# EAGLE design motherboard_v1 (EAGLE 7.2.0)
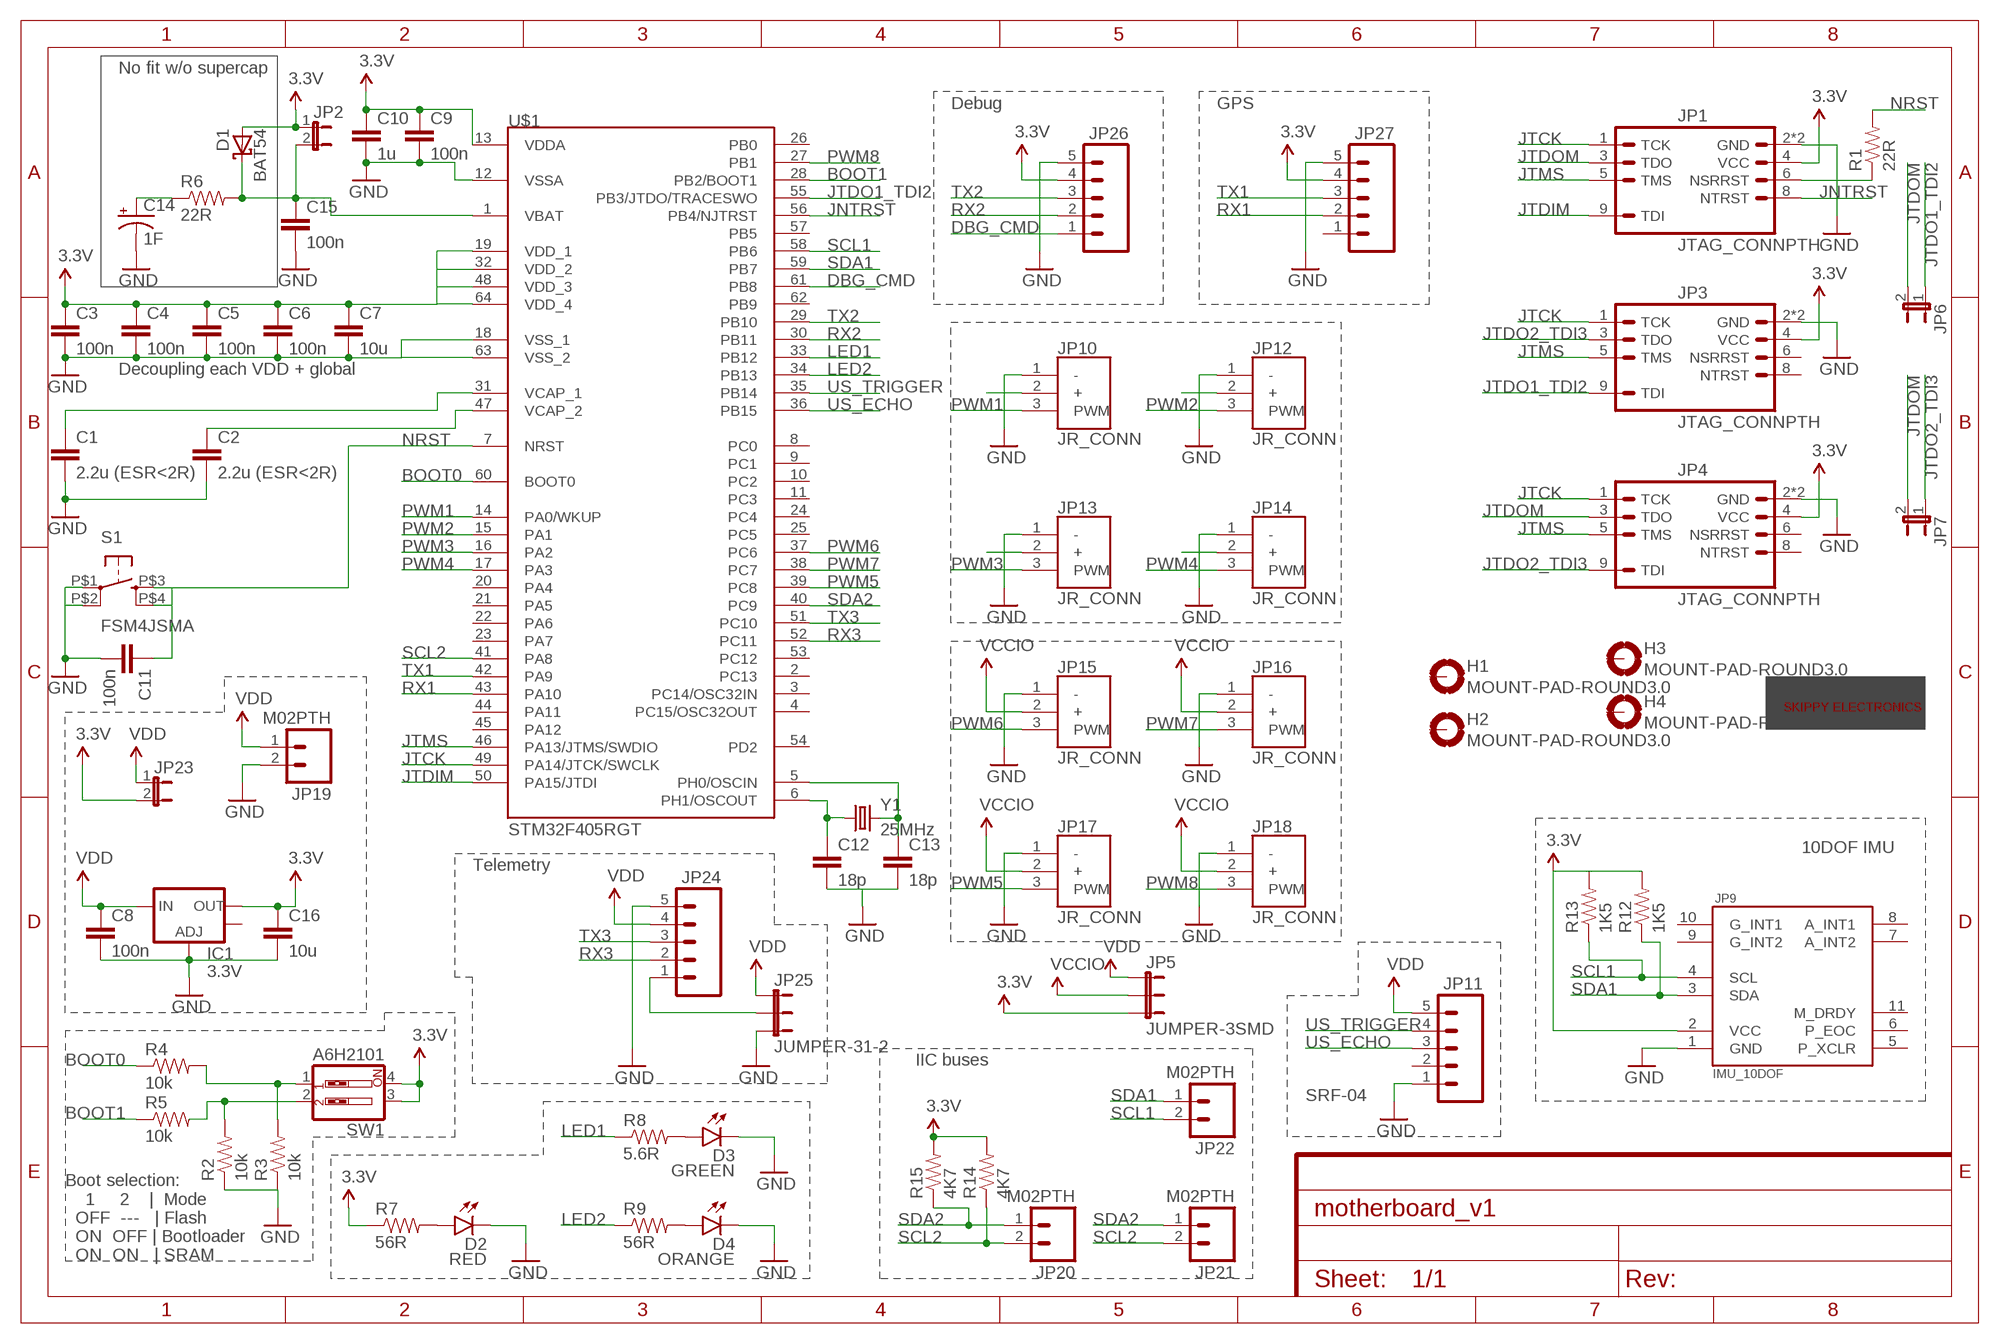
[diagram p0: schematic, sheet 1]
FRAME1 (FRAME-A4L): CNAME: SkippyElectronics; CREVISION: 1.0.0; DESIGNER: Christophe Huriaux

## Parts
C1  2.2u (ESR<2R)  CAP1206  [1206]
C2  2.2u (ESR<2R)  CAP1206  [1206]
C3  100n  CAP0805  [0805]
C4  100n  CAP0805  [0805]
C5  100n  CAP0805  [0805]
C6  100n  CAP0805  [0805]
C7  10u  CAP1206  [1206]
C8  100n  CAP1206  [1206]
C9  100n  CAP0805  [0805]
C10  1u  CAP1206  [1206]
C11  100n  CAP1206  [1206]
C12  18p  CAP1206  [1206]
C13  18p  CAP1206  [1206]
C14  1F  SUPERCAP  [CPOL-RADIAL-D165-P508]
C15  100n  CAP0805  [0805]
C16  10u  CAP1206  [1206]
D1  BAT54  [SOT23]
D2  RED  LED1206  [LED-1206]
D3  GREEN  LED1206  [LED-1206]
D4  ORANGE  LED1206  [LED-1206]
H1  MOUNT-PAD-ROUND3.0  [3,0-PAD]
H2  MOUNT-PAD-ROUND3.0  [3,0-PAD]
H3  MOUNT-PAD-ROUND3.0  [3,0-PAD]
H4  MOUNT-PAD-ROUND3.0  [3,0-PAD]
IC1  3.3V  V_REG_LM1117SOT223  [SOT223]
JP1  JTAG_CONNPTH  [AVR_ICSP]
JP2  JUMPER-2SMD-NO  [SJ_2S-NO]
JP3  JTAG_CONNPTH  [AVR_ICSP]
JP4  JTAG_CONNPTH  [AVR_ICSP]
JP5  JUMPER-3SMD  [SJ_3]
JP6  JUMPER-2SMD-NO  [SJ_2S-NO]
JP7  JUMPER-2SMD-NO  [SJ_2S-NO]
JP9  IMU_10DOF  [IMU_10DOF]
JP10  JR_CONN  [1X03]
JP11  M05PTH  [1X05]
JP12  JR_CONN  [1X03]
JP13  JR_CONN  [1X03]
JP14  JR_CONN  [1X03]
JP15  JR_CONN  [1X03]
JP16  JR_CONN  [1X03]
JP17  JR_CONN  [1X03]
JP18  JR_CONN  [1X03]
JP19  M02PTH  [1X02]
JP20  M02PTH  [1X02]
JP21  M02PTH  [1X02]
JP22  M02PTH  [1X02]
JP23  JUMPER-2SMD-NO  [SJ_2S-NO]
JP24  M05PTH  [1X05]
JP25  JUMPER-31-2  [SJ_3_PASTE1&2]
JP26  M05PTH  [1X05]
JP27  M05PTH  [1X05]
R1  22R  RESISTOR1206  [1206]
R2  10k  RESISTOR1206  [1206]
R3  10k  RESISTOR1206  [1206]
R4  10k  RESISTOR1206  [1206]
R5  10k  RESISTOR1206  [1206]
R6  22R  RESISTOR1206  [1206]
R7  56R  RESISTOR1206  [1206]
R8  5.6R  RESISTOR1206  [1206]
R9  56R  RESISTOR1206  [1206]
R12  1K5  RESISTOR1206  [1206]
R13  1K5  RESISTOR1206  [1206]
R14  4K7  RESISTOR1206  [1206]
R15  4K7  RESISTOR1206  [1206]
S1  FSM4JSMA  TAC_SWITCH  [TYCO-FSM4JSMA]
SW1  A6H2101  SW_DIP-2-SMT-HALFSIZE  [DIPSWITCH-02-50MIL]
U$1  STM32F405RGT  [LQFP-ST-64-2]
U$2  SKIPPYTXT-PLC-10MM  [SKIPPYTXT-PLC-10MM]
Y1  25MHz  CRYSTALSMD  [HC49UP]

## Nets
3.3V: C3.1 C4.1 C5.1 C6.1 C7.1 C9.1 C10.1 C16.1 D1.1(A) IC1.2(OUT) JP1.4(VCC) JP2.1 JP3.4(VCC) JP4.4(VCC) JP5.3 JP9.2(VCC) JP23.2 JP26.4 JP27.4 R7.1 R12.2 R13.2 R14.2 R15.2 SW1.3 SW1.4 U$1.13(VDDA) U$1.19(VDD_1) U$1.32(VDD_2) U$1.48(VDD_3) U$1.64(VDD_4)
BOOT0: R4.1 U$1.60(BOOT0)
BOOT1: R5.1 U$1.28(PB2/BOOT1)
DBG_CMD: JP26.1 U$1.61(PB8)
GND: C1.2 C2.2 C3.2 C4.2 C5.2 C6.2 C7.2 C8.2 C9.2 C10.2 C11.2 C12.2 C13.2 C14.2(-) C15.2 C16.2 D2.C D3.C D4.C IC1.1(ADJ) JP1.2(GND) JP1.10(GND) JP3.2(GND) JP3.10(GND) JP4.2(GND) JP4.10(GND) JP9.1(GND) JP10.1(-) JP11.1 JP12.1(-) JP13.1(-) JP14.1(-) JP15.1(-) JP16.1(-) JP17.1(-) JP18.1(-) JP19.2 JP24.5 JP25.3 JP26.5 JP27.5 R2.1 R3.1 S1.P$1 S1.P$2 U$1.12(VSSA) U$1.18(VSS_1) U$1.63(VSS_2)
JNTRST: JP1.8(NTRST) U$1.56(PB4/NJTRST)
JTCK: JP1.1(TCK) JP3.1(TCK) JP4.1(TCK) U$1.49(PA14/JTCK/SWCLK)
JTDIM: JP1.9(TDI) U$1.50(PA15/JTDI)
JTDO1_TDI2: JP3.9(TDI) JP6.1 U$1.55(PB3/JTDO/TRACESWO)
JTDO2_TDI3: JP3.3(TDO) JP4.9(TDI) JP7.1
JTDOM: JP1.3(TDO) JP4.3(TDO) JP6.2 JP7.2
JTMS: JP1.5(TMS) JP3.5(TMS) JP4.5(TMS) U$1.46(PA13/JTMS/SWDIO)
LED1: R8.1 U$1.33(PB12)
LED2: R9.1 U$1.34(PB13)
N$1: C1.1 U$1.31(VCAP_1)
N$2: C2.1 U$1.47(VCAP_2)
N$3: C12.1 U$1.6(PH1/OSCOUT) Y1.1
N$4: JP1.6(NSRRST) R1.1
N$5: C13.1 U$1.5(PH0/OSCIN) Y1.2
N$6: R3.2 R4.2 SW1.1
N$7: R2.2 R5.2 SW1.2
N$8: D2.A R7.2
N$9: C14.1(+) R6.1
N$10: C15.1 D1.3(C) JP2.2 R6.2 U$1.1(VBAT)
N$11: D3.A R8.2
N$13: JP24.1 JP25.2
N$14: JP10.2(+)
N$15: D4.A R9.2
N$16: JP12.2(+)
N$17: JP14.2(+)
N$18: JP13.2(+)
NRST: C11.1 R1.2 S1.P$3 S1.P$4 U$1.7(NRST)
PWM1: JP10.3(PWM) U$1.14(PA0/WKUP)
PWM2: JP12.3(PWM) U$1.15(PA1)
PWM3: JP13.3(PWM) U$1.16(PA2)
PWM4: JP14.3(PWM) U$1.17(PA3)
PWM5: JP17.3(PWM) U$1.39(PC8)
PWM6: JP15.3(PWM) U$1.37(PC6)
PWM7: JP16.3(PWM) U$1.38(PC7)
PWM8: JP18.3(PWM) U$1.27(PB1)
RX1: JP27.2 U$1.43(PA10)
RX2: JP26.2 U$1.30(PB11)
RX3: JP24.2 U$1.52(PC11)
SCL1: JP9.4(SCL) JP22.2 R13.1 U$1.58(PB6)
SCL2: JP20.2 JP21.2 R14.1 U$1.41(PA8)
SDA1: JP9.3(SDA) JP22.1 R12.1 U$1.59(PB7)
SDA2: JP20.1 JP21.1 R15.1 U$1.40(PC9)
TX1: JP27.3 U$1.42(PA9)
TX2: JP26.3 U$1.29(PB10)
TX3: JP24.3 U$1.51(PC10)
US_ECHO: JP11.3 U$1.36(PB15)
US_TRIGGER: JP11.4 U$1.35(PB14)
VCCIO: JP5.2 JP15.2(+) JP16.2(+) JP17.2(+) JP18.2(+)
VDD: C8.1 IC1.3(IN) JP5.1 JP11.5 JP19.1 JP23.1 JP24.4 JP25.1
Unconnected: H1.B3,0(MOUNT) H2.B3,0(MOUNT) H3.B3,0(MOUNT) H4.B3,0(MOUNT) IC1.4(OUT) JP3.6(NSRRST) JP3.8(NTRST) JP4.6(NSRRST) JP4.8(NTRST) JP9.5(P_XCLR) JP9.6(P_EOC) JP9.7(A_INT2) JP9.8(A_INT1) JP9.9(G_INT2) JP9.10(G_INT1) JP9.11(M_DRDY) JP11.2 JP27.1 U$1.2(PC13) U$1.3(PC14/OSC32IN) U$1.4(PC15/OSC32OUT) U$1.8(PC0) U$1.9(PC1) U$1.10(PC2) U$1.11(PC3) U$1.20(PA4) U$1.21(PA5) U$1.22(PA6) U$1.23(PA7) U$1.24(PC4) U$1.25(PC5) U$1.26(PB0) U$1.44(PA11) U$1.45(PA12) U$1.53(PC12) U$1.54(PD2) U$1.57(PB5) U$1.62(PB9)

## Notes on the sheet
- No fit w/o supercap
- Debug | GPS
- Decoupling each VDD + global
- 10DOF IMU
- Telemetry
- IIC buses
- SRF-04
- Boot selection:
      1     2    |  Mode
    OFF  ---   | Flash 
    ON  OFF | Bootloader
    ON  ON   | SRAM

## Library data of the parts
C1-C13 C15 C16 = SparkFun-Capacitors:CAP: Capacitor Standard 0603 ceramic capacitor, and 0.1" leaded capacitor.
C14 = Skippy-Passive:SUPERCAP: Supercap 1F supercap
D1 = diode:BAT54: Schottky Diodes Source: Fairchild .. BAT54.pdf
D2-D4 = SparkFun-LED:LED: LEDs Standard schematic elements and footprints for 5mm, 3mm, 1206, and 0603 sized LEDs. 5mm - Spark Fun Electronics SKU : COM-00529 (and others)
H1-H4 = holes:MOUNT-PAD-ROUND: MOUNTING PAD, round
IC1 = SparkFun-PowerIC:V_REG_LM1117: Voltage Regulator LM1117 Standard adjustable voltage regulator but in SMD form. Spark Fun Electronics SKU : COM-00595; PROD_ID: VREG-08170
JP1 JP3 JP4 = connectors:JTAG_CONN: Header 5x2 Standard 10-pin dual row 0.1" header. Commonly used with AVR-ISP. Use with Spark Fun Electronics SKU: PRT-00778
JP2 JP6 JP7 JP23 = SparkFun-Retired:JUMPER-2: Jumper Basic 0.1" spaced jumper. Use with breakaway headers.
JP5 JP25 = SparkFun-Retired:JUMPER-3
JP9 = Skippy-ExtBoards:IMU_10DOF
JP10 JP12-JP18 = Skippy-Connectors:JR_CONN
JP11 JP24 JP26 JP27 = SparkFun-Connectors:M05: Header 5 Standard 5-pin 0.1" header. Use with straight break away headers (SKU : PRT-00116), right angle break away headers (PRT-00553), swiss pins (PRT-00743), machine pins (PRT-00117), and female headers (PRT-00115). Molex polarized connector foot print use with SKU : PRT-08230 with associated crimp pins and housings.
JP19-JP22 = SparkFun-Connectors:M02: Standard 2-pin 0.1" header. Use with - straight break away headers ( PRT-00116) - right angle break away headers (PRT-00553) - swiss pins (PRT-00743) - machine pins (PRT-00117) - female headers (PRT-00115) Molex polarized connector foot print use with: PRT-08233 with associated crimp pins and housings. 2.54_SCREWTERM for use with PRT-10571. 3.5mm Screw Terminal footprints for PRT-08084 5mm Screw Terminal footprints for use with PRT-08432
R1-R9 R12-R15 = SparkFun-Resistors:RESISTOR: Resistor Basic schematic elements and footprints for 0603, 1206, and PTH resistors.
S1 = meca:TAC_SWITCH: Momentary Switch Button commonly used for reset or general input. Spark Fun Electronics SKU : COM-00097 SMT- SWCH-08247
SW1 = SparkFun-Electromechanical:SW_DIP-2: DIP SWITCH
U$1 = stm32:STM32F405RG
U$2 = skippy-logo:SKIPPYTXT-PLC-10MM
Y1 = SparkFun-FreqCtrl:CRYSTAL: Various standard crystals. Proven footprints.

## Board
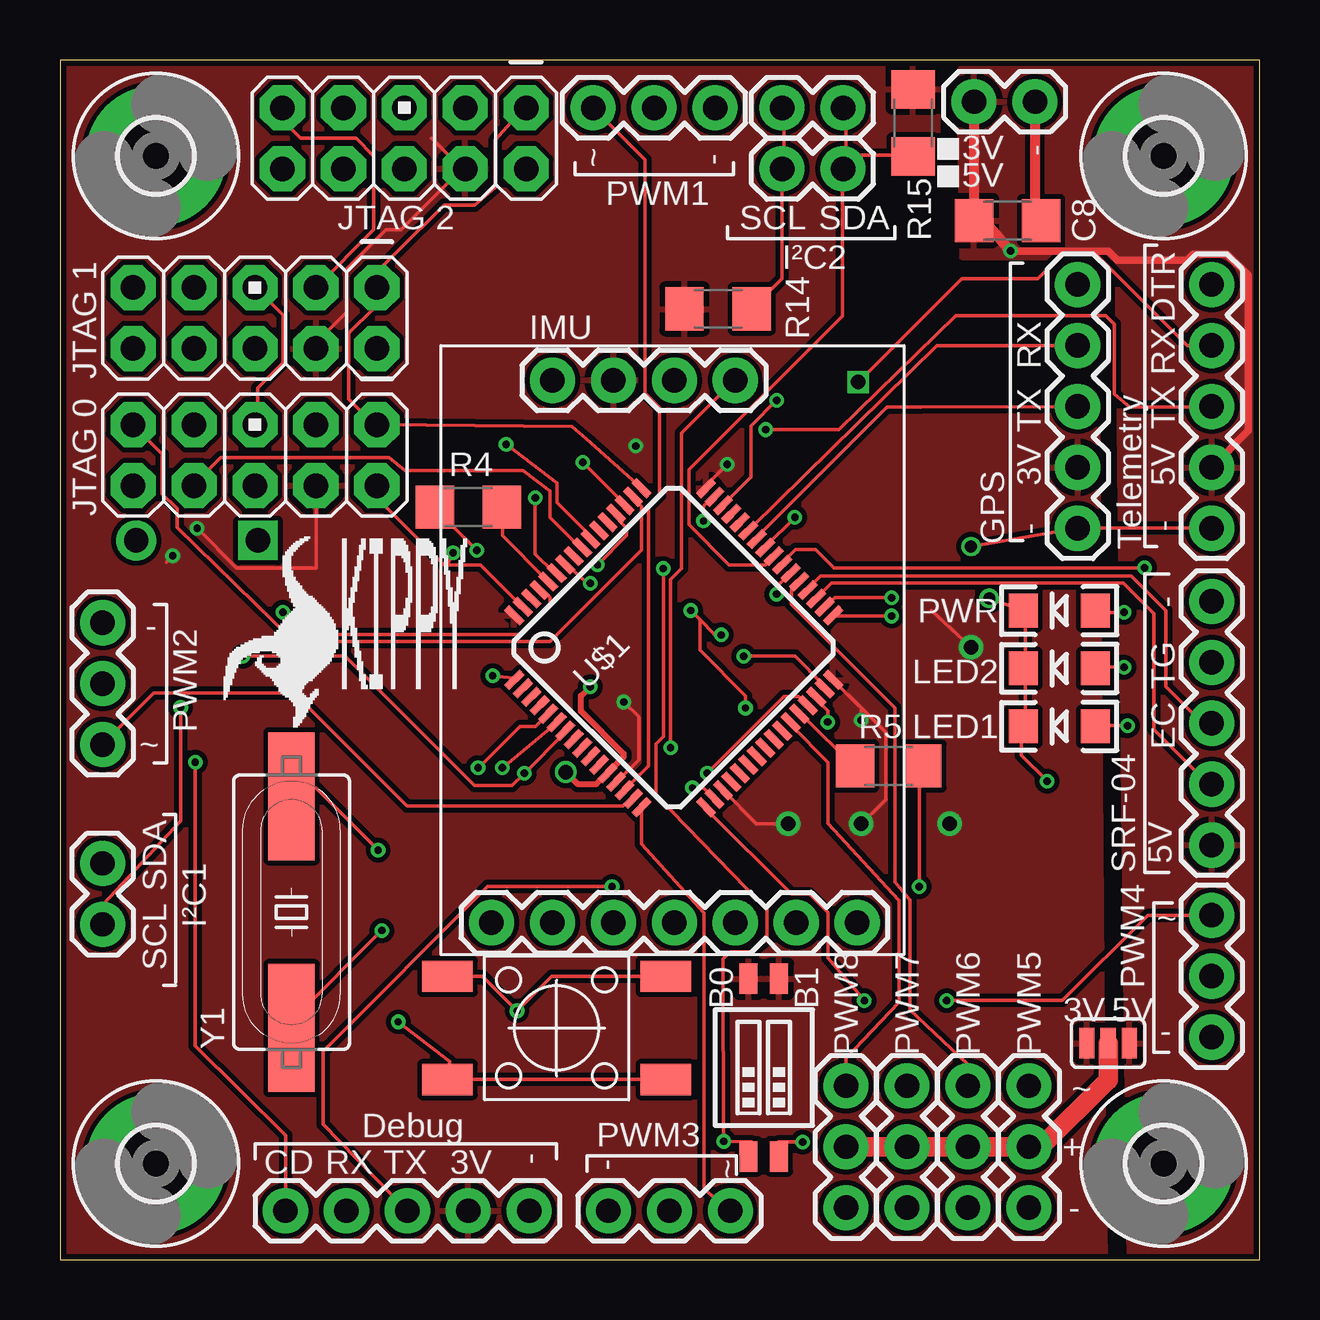
[diagram p1: board, top side]
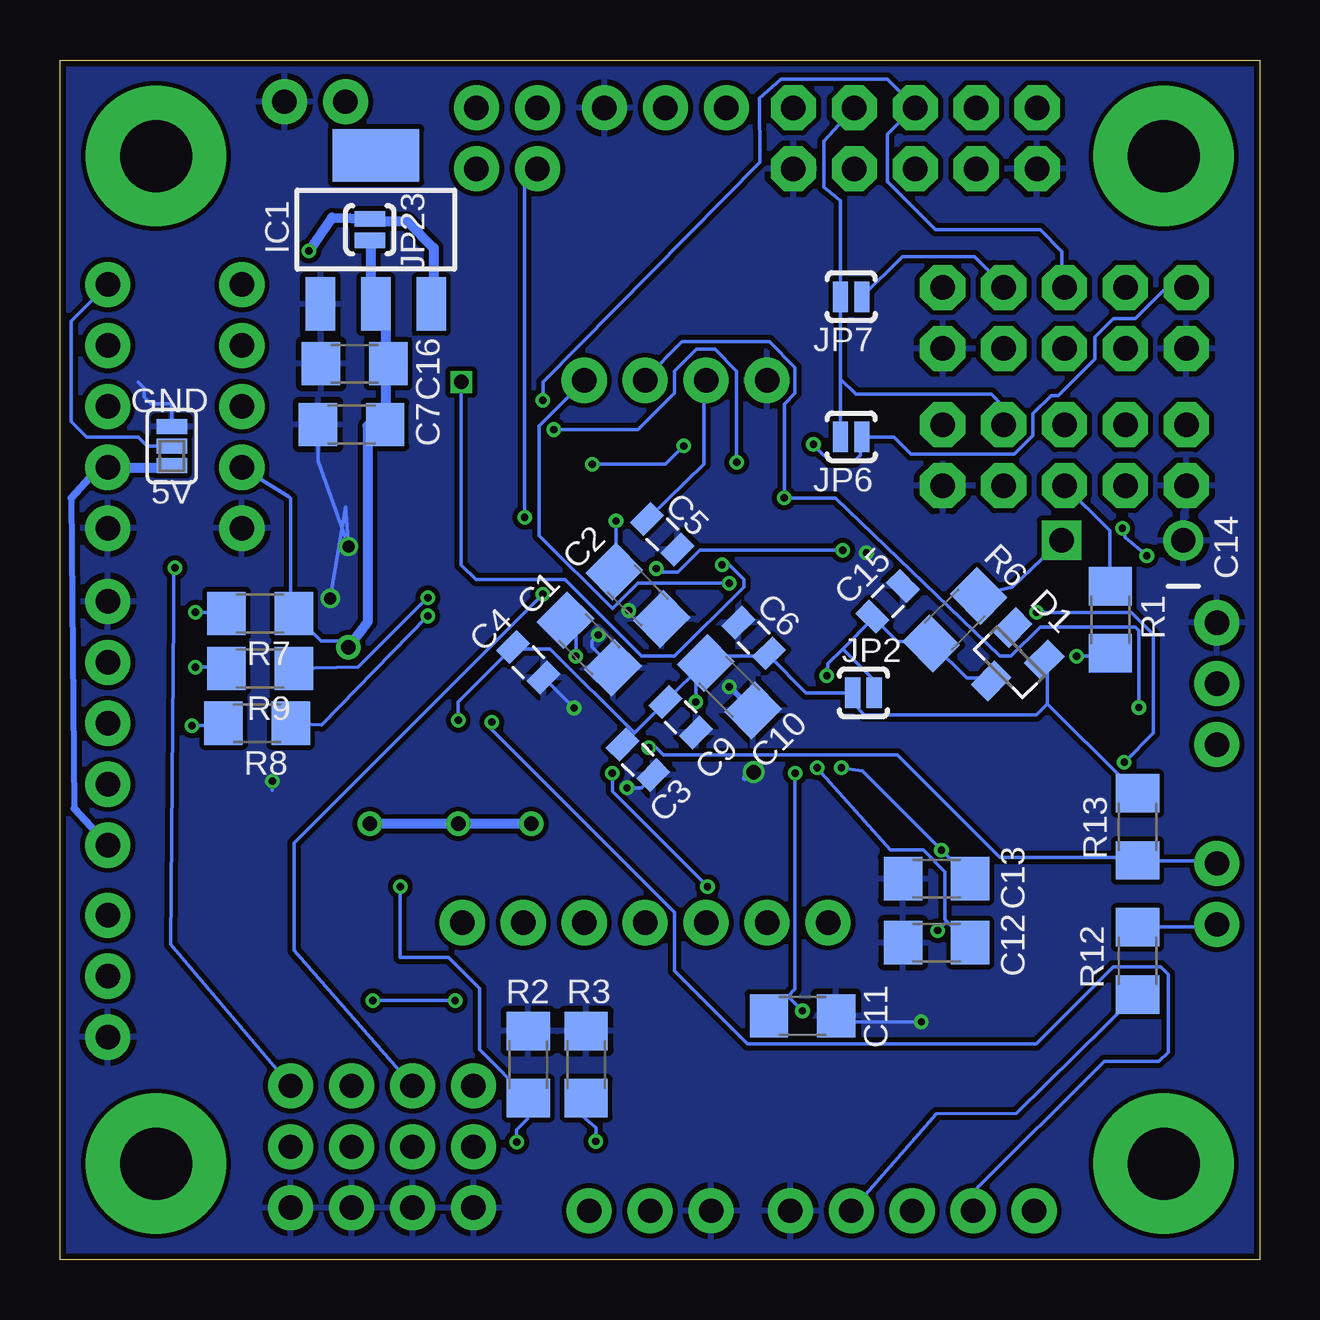
[diagram p2: board, bottom side, seen from below]

Size 50 x 50 mm. Coordinates in mm from the lower left corner, seen from the top.
Outline: 0,0 50,0 50,50 0,50 0,0
Copper layers (1*16): Top 0.035mm / dielectric 1.5mm / Bottom 0.035mm
Design rules "SeeedStudio_2layer_DRU_no_angle_20140221": minimum track width 6mil, minimum drill 12mil, track to track 6mil, track to pad 6mil, pad to pad 6mil, via to via 6mil, smd to smd 0mil, copper to edge 10mil, drill to drill 10mil, minimum pad ring 10mil, minimum via ring 6mil, stop-mask expansion 2mil, vias tented up to drill 100mil, thermal gap 10mil

### Footprints (pad centres in the part's own frame; a part is rotated, then mirrored left to right if it is on the bottom)
1206 = smd 1.6 x 1.8: 1 -1.4,0; 2 1.4,0
0805 = smd 0.8 x 1.2: 1 -0.9,0; 2 0.9,0
CPOL-RADIAL-D165-P508 = drill 1.016 pad 1.651 square: 1 2.54,0 | drill 1.016 pad 1.676: 2 -2.54,0
SOT23 = smd 1 x 1.4: 1 -0.95,-1.1; 2 0.95,-1.1; 3 0,1.1
LED-1206 = smd 1.2 x 1.4: A -1.5,0; C 1.5,0
3,0-PAD = drill 3 pad 5.842: B3,0 0,0
SOT223 = smd 1.219 x 2.235: 1 -2.311,-3.099; 2 0,-3.099; 3 2.311,-3.099 | smd 3.6 x 2.2: 4 0,3.099
AVR_ICSP = drill 1.016 pad 1.88 octagon: 1 -1.27,5.08; 2 1.27,5.08; 3 -1.27,2.54; 4 1.27,2.54; 5 -1.27,0; 6 1.27,0; 7 -1.27,-2.54; 8 1.27,-2.54; 9 -1.27,-5.08; 10 1.27,-5.08
SJ_2S-NO = smd 0.635 x 1.27: 1 -0.45,0; 2 0.45,0
SJ_3 = smd 0.635 x 1.27: 1 -0.889,0; 2 0,0; 3 0.889,0
IMU_10DOF = drill 1.016 pad 1.88: 1 -11.246,-5; 2 -11.246,-2.46; 3 -11.246,0.08; 4 -11.246,2.62; 5 11.36,-7.54; 6 11.36,-5; 7 11.36,-2.46; 8 11.36,0.08; 9 11.36,2.62; 10 11.36,5.16; 11 11.36,7.7
1X03 = drill 1.016 pad 1.88: 1 0,0; 2 2.54,0; 3 5.08,0
1X05 = drill 1.016 pad 1.88: 1 0,0; 2 2.54,0; 3 5.08,0; 4 7.62,0; 5 10.16,0
1X02 = drill 1.016 pad 1.88: 1 0,0; 2 2.54,0
SJ_3_PASTE1&2 = smd 0.635 x 1.27: 1 -0.813,0; 2 0,0; 3 0.813,0
TYCO-FSM4JSMA = smd 1.3 x 2.1: P$1 -2.15,4.55; P$2 -2.15,-4.55; P$3 2.15,4.55; P$4 2.15,-4.55
DIPSWITCH-02-50MIL = smd 0.762 x 1.27: 1 -0.635,-3.7; 2 0.635,-3.7; 3 0.635,3.7; 4 -0.635,3.7
LQFP-ST-64-2 = smd 0.9 x 0.3: 1 -5.65,3.75; 2 -5.65,3.25; 3 -5.65,2.75; 4 -5.65,2.25; 5 -5.65,1.75; 6 -5.65,1.25; 7 -5.65,0.75; 8 -5.65,0.25; 9 -5.65,-0.25; 10 -5.65,-0.75; 11 -5.65,-1.25; 12 -5.65,-1.75; 13 -5.65,-2.25; 14 -5.65,-2.75; 15 -5.65,-3.25; 16 -5.65,-3.75; 33 5.65,-3.75; 34 5.65,-3.25; 35 5.65,-2.75; 36 5.65,-2.25; 37 5.65,-1.75; 38 5.65,-1.25; 39 5.65,-0.75; 40 5.65,-0.25; 41 5.65,0.25; 42 5.65,0.75; 43 5.65,1.25; 44 5.65,1.75; 45 5.65,2.25; 46 5.65,2.75; 47 5.65,3.25; 48 5.65,3.75 | smd 0.3 x 0.9: 17 -3.75,-5.65; 18 -3.25,-5.65; 19 -2.75,-5.65; 20 -2.25,-5.65; 21 -1.75,-5.65; 22 -1.25,-5.65; 23 -0.75,-5.65; 24 -0.25,-5.65; 25 0.25,-5.65; 26 0.75,-5.65; 27 1.25,-5.65; 28 1.75,-5.65; 29 2.25,-5.65; 30 2.75,-5.65; 31 3.25,-5.65; 32 3.75,-5.65; 49 3.75,5.65; 50 3.25,5.65; 51 2.75,5.65; 52 2.25,5.65; 53 1.75,5.65; 54 1.25,5.65; 55 0.75,5.65; 56 0.25,5.65; 57 -0.25,5.65; 58 -0.75,5.65; 59 -1.25,5.65; 60 -1.75,5.65; 61 -2.25,5.65; 62 -2.75,5.65; 63 -3.25,5.65; 64 -3.75,5.65
HC49UP = smd 5.334 x 1.93: 1 -4.826,0; 2 4.826,0

### Placement (x,y rotation side)
C1  27.94,25.65 315 bottom
C2  25.91,27.69 315 bottom
C3  25.91,20.83 315 bottom
C4  30.48,24.89 315 bottom
C5  24.89,30.23 315 bottom
C6  21.08,25.91 135 bottom
C7  37.85,34.8 180 bottom
C8  39.5,43.31 0 top
C9  24.13,22.61 315 bottom
C10  22.1,23.88 315 bottom
C11  19.05,10.16 0 bottom
C12  13.46,13.21 180 bottom
C13  13.46,15.88 180 bottom
C14  5.71,29.97 180 bottom
C15  15.49,27.43 45 bottom
C16  37.72,37.34 180 bottom
D1  10.41,24.89 135 bottom
D2  41.66,27.05 180 top
D3  41.66,22.23 180 top
D4  41.66,24.64 180 top
H1  46,46 180 top
H2  46,4 0 top
H3  4,46 0 top
H4  4,4 0 top
IC1  36.83,42.93 0 bottom
JP1  8.13,33.53 270 top
JP2  16.51,23.62 0 bottom
JP3  8.13,39.24 270 top
JP4  14.35,46.74 270 top
JP5  43.69,9.02 180 top
JP6  17.02,34.29 180 bottom
JP7  17.02,40.13 180 bottom
JP9  25.53,25.4 270 top
JP10  27.3,48.01 180 top
JP11  48.01,27.43 270 top
JP12  1.78,26.54 270 top
JP13  22.86,2.03 0 top
JP14  48.01,9.27 90 top
JP15  37.85,2.16 90 top
JP16  35.31,2.16 90 top
JP17  40.39,2.16 90 top
JP18  32.77,2.16 90 top
JP19  38.1,48.26 0 top
JP20  32.64,45.47 180 top
JP21  32.64,48.01 180 top
JP22  1.78,13.97 90 top
JP23  37.08,42.93 270 bottom
JP24  48.01,40.64 270 top
JP25  45.34,33.91 90 bottom
JP26  9.4,2.03 0 top
JP27  42.42,40.64 270 top
R1  6.22,26.67 270 bottom
R2  30.48,8.13 270 bottom
R3  28.07,8.13 270 bottom
R4  17.02,31.37 180 top
R5  34.54,20.57 0 top
R6  12.7,26.67 225 bottom
R7  41.66,26.92 180 bottom
R8  41.78,22.35 180 bottom
R9  41.66,24.64 180 bottom
R12  5.08,12.45 270 bottom
R13  5.08,18.03 90 bottom
R14  27.43,39.62 180 top
R15  35.56,47.37 90 top
S1  20.7,9.65 90 top
SW1  29.34,8 0 top
U$1  25.58,25.5 45 top
U$2  6.86,22.23 0 top
Y1  9.65,14.48 90 top

### Tracks (layer width: path | path; a pad name or v marks a point on that pad's centre or on a via)
3.3V  (via drill 0.3, 0.6 pad 1.02)
  Top 0.152: v33.4,22.48 33.4,22.99 U$1.32 34.42,21.97 34.42,19.18 v33.4,18.16 | v30.35,18.16 29.04,18.16 U$1.19 | v37.08,18.16 37.21,18.16 | v37.97,25.53 36.32,27.05 | U$1.13 23.22,19.92 24.13,20.83 24.13,22.61 v23.5,23.24 | JP1.4 10.67,28.83 7.37,28.83 v5.71,30.48 | v4.7,29.34 4.45,29.08 | JP3.4 10.67,38.23 11.94,39.5 11.94,41.27 13.59,42.93 14.22,42.93 16.76,45.47 | 16.76,45.47 15.49,46.74 | U$1.48 26.93,32.26 v27.81,33.15 | v24,33.91 24,34.16 | 17.02,45.47 JP4.4 16.76,45.47
  Bottom 0.152: C10.1 23.01,24.99 22.86,25.15 20.57,25.15 C6.1 20.42,25.15 18.9,23.62 JP2.1 16.92,23.62 16.92,23.16 16.46,22.71 9.3,22.71 8.84,23.16 | C10.1 23.16,24.84 24.69,23.32 C9.1 24.84,23.16 26.06,21.95 | 26.06,21.95 26.52,21.49 C3.1 | 31.09,25.45 29.57,25.45 26.06,21.95 | 31.09,25.45 C4.1 | 8.84,23.16 8.84,24.99 D1.1 | 5.64,19.96 5.18,19.51 R13.2 5.64,19.96 | 5.64,19.96 8.84,23.16 | 36.42,34.9 C7.1 36.58,34.75 37.19,34.75 | 37.03,40.08 36.88,39.93 IC1.2 36.73,39.78 36.42,39.47 | 37.03,42.37 JP23.2 | 36.42,37.34 C16.1 | C5.1 25.45,30.94 23.16,33.15 23.16,36.58 JP9.2 | R12.2 5.18,10.97 10.13,6.1 13.46,6.07 JP26.4 | JP27.4 40.46,31.8 40.39,31.73 40.39,26.98 R7.1 39.11,25.78 37.97,25.78 37.19,26.57 | 31.09,25.45 31.19,25.45 33.4,23.24 v33.4,22.48 | v33.4,18.16 v30.35,18.16 | v23.5,23.24 23.5,24.46 C10.1 | v5.71,30.48 5.59,30.1 v4.7,29.34 | v27.81,33.15 24.77,33.15 v24,33.91
  Bottom 0.406: 36.42,34.9 36.42,37.34 36.42,39.47 | 37.03,40.08 37.03,42.37 | 37.19,34.75 37.19,26.57 v37.97,25.53 | v30.35,18.16 v37.08,18.16
  pour Top (isolate 0.203): -0.37,50.93 36.58,50.29 36.58,41.27 43.18,41.15 43.43,9.27 43.56,-0.13 31.11,-0.25 -0.38,-0.13
BOOT0
  Top 0.152: U$1.60 20.27,28.35 18.44,30.18 18.44,31.24 R4.1
BOOT1
  Top 0.152: U$1.28 30.94,22.71 33.07,20.57 R5.1
DBG_CMD  (via drill 0.3)
  Top 0.152: v9.3,26.98 10.21,26.06 19.2,26.06 20.42,27.28 20.42,27.58 20.12,27.89 U$1.61 | v5.64,20.73 5.64,8.91 9.4,5.18 JP26.1
  Bottom 0.152: v9.3,26.98 5.33,26.98 4.42,26.06 4.42,21.95 v5.64,20.73
GND  (via drill 0.3, 0.5, 0.6)
  Top 0.152: 16.13,28.96 17.53,28.96 19.2,27.28 U$1.63 | JP1.2 13.26,32.21 13.26,31.7 16,28.96 16.13,28.96 | v26.36,19.66 26.82,19.66 27.13,19.36 U$1.18 | v38.73,27.56 D2.C 40.23,26.98 40.23,24.69 D4.C 40.23,24.54 40.23,22.25 D3.C 40.23,22.1 40.08,22.1 40.08,21.01 v41.15,19.94 | v37.97,29.72 JP27.5 JP24.5 | v14.1,9.91 16.25,8.26 S1.P$1 S1.P$2 | v28.57,22.99 28.57,23.5 26.67,25.4 26.67,26.67 | 26.67,26.67 v26.29,27.05 | v27.56,26.04 27.3,26.04 26.67,26.67 | 16.13,28.96 v16.38,29.46
  Top 0.254: v21.08,20.32 21.59,19.81 22.35,19.81 U$1.12 22.82,20.28 23.5,20.95 23.5,21.08 21.72,22.86 21.72,23.5 v22.1,23.88
  Top 0.406: JP19.2 40.64,43.31 C8.2
  Bottom 0.152: v26.36,19.66 25.76,19.66 25.3,20.12 C3.2 | v38.73,27.56 38.1,31.37 v37.97,29.72 39.25,33.27 C7.2 | v14.1,9.91 17.4,9.91 C11.2 | C4.2 | C4.2 v28.57,22.99 | v26.29,27.05 26.16,27.18 | C1.2 | C1.2 27.81,25.53 27.81,25.78 v27.56,26.04 | v16.38,29.46 16.13,29.59 | v41.15,19.94 41.15,19.56 | JP25.3 45.34,35.69 46.23,35.69 46.48,35.94 46.48,36.32 46.74,36.58
  Bottom 0.254: v21.08,20.32 21.46,20.07 21.34,20.19 | v22.1,23.88 | v22.1,23.88 C10.2
  pour Bottom (isolate 0.203): -0.25,50.55 0,0 50.04,0 50.29,50.55
JNTRST
  Top 0.152: U$1.56 21.64,29.72 20.42,30.94 20.42,32.03 19.3,32.89 14.38,32.89 13.72,33.43 6.71,33.43 5.64,32.36 JP1.8
JTCK
  Top 0.152: JP4.1 19.33,47.98 18.14,46.66 18.14,44.68 17.27,43.94 16,43.94 14.02,41.96 13.11,41.07 13.11,40.59 JP3.1 13.11,40.44 13.11,39.67 12.04,38.61 12.04,35.87 13.11,34.8 JP1.1 13.26,34.8 21.34,34.72 21.92,34.21 U$1.49
JTDIM
  Top 0.152: JP1.9 4.27,33.58 4.27,31.9 4.88,31.29 4.88,30.5 9.75,25.76 20.42,25.76 24.23,29.57 24.23,31.39 23.93,31.7 U$1.50
JTDO1_TDI2  (via drill 0.3)
  Top 0.152: v18.59,33.98 20.73,32.36 20.73,31.55 22.1,30.18 U$1.55
  Bottom 0.152: JP3.9 3.05,40.44 3.96,40.44 5.18,39.22 6.1,39.22 6.86,38.46 6.86,37.54 8.38,36.02 8.69,36.02 9.45,35.26 9.45,34.34 10.21,33.58 14.53,33.58 15.24,34.29 JP6.1 16.64,34.22 16.64,33.53 16.89,33.27 17.91,33.27 18.34,33.71 v18.59,33.98
JTDO2_TDI3
  Top 0.152: 10.67,40.59 JP3.3 13.08,42.93 13.08,46 12.34,46.74 10.03,46.74 9.27,47.5 JP4.9
  Bottom 0.152: JP3.3 10.67,40.59 11.89,41.81 14.89,41.81 JP7.1
JTDOM
  Bottom 0.152: JP4.3 18.16,46.61 18.16,44.7 17.47,44.14 JP7.2 17.47,36.7 | 17.47,36.7 JP6.2 | JP1.3 10.67,35.56 11.18,36.07 16.83,36.07 17.47,36.7
JTMS  (via drill 0.3)
  Top 0.152: JP1.5 8.23,34.8 8.23,36.32 9.3,37.39 9.3,39.37 8.23,40.44 JP3.5 | v29.87,35.81 28.8,34.75 28.8,32.61 27.74,31.55 U$1.46
  Bottom 0.152: v29.87,35.81 29.87,36.58 20.83,45.74 20.85,48.41 19.94,49.2 15.52,49.2 14.45,48.13 JP4.5 14.45,47.98 15.52,46.91 15.52,44.93 13.51,42.93 9.14,42.93 8.23,42.01 8.23,40.59 JP3.5
LED1  (via drill 0.3)
  Top 0.152: v34.67,26.82 32.31,26.82 U$1.33
  Bottom 0.152: v34.67,26.82 39.09,22.28 R8.1
LED2  (via drill 0.3)
  Top 0.152: v34.67,27.58 32.31,27.58 32,27.28 U$1.34
  Bottom 0.152: v34.67,27.58 37.57,24.69 R9.1
N$1  (via drill 0.3)
  Top 0.152: v28.5,25.15 30.63,25.15 31.85,23.93 U$1.31
  Bottom 0.152: v28.5,25.15 28.5,26.21 28.8,26.52 C1.1
N$2  (via drill 0.3)
  Top 0.152: v26.82,30.79 26.82,31.39 26.87,31.45 U$1.47
  Bottom 0.152: v26.82,30.79 26.82,28.8 C2.1
N$3  (via drill 0.3)
  Top 0.152: v18.44,20.5 20.57,22.25 U$1.6 | v13.41,13.72 9.75,10.06 Y1.1
  Bottom 0.152: v18.44,20.5 15.39,17.07 14.02,17.07 13.11,16.15 13.11,14.17 12.95,14.02 | 12.95,14.02 12.19,13.26 C12.1 | v13.41,13.72 13.11,14.02 12.95,14.02
N$4
  Bottom 0.152: JP1.6 6.25,30.38 6.25,28.19 R1.1
N$5  (via drill 0.3)
  Top 0.152: v13.26,17.07 10.67,19.66 9.75,19.66 Y1.2 | v17.42,20.5 17.45,20.5 19.18,22.23 19.83,22.23 U$1.5
  Bottom 0.152: v17.42,20.5 16.56,20.37 v13.26,17.07 12.19,16 C13.1
N$6  (via drill 0.3)
  Top 0.152: SW1.1 28.83,4.9 v27.66,4.93 27.64,12.45 27.64,12.52 27.94,12.83 28.83,12.83 29.46,13.34 29.46,14.61 29.29,14.78 24.84,19.36 24.84,21.49 25.15,21.79 v25.15,28.8 | v17.37,29.57 15.7,31.24 R4.2
  Bottom 0.152: v27.66,4.93 27.66,5.49 28.57,6.27 R3.2 | v17.37,29.57 23.32,29.57 24.23,28.65 24.99,28.65 v25.15,28.8
N$7  (via drill 0.3)
  Top 0.152: v30.96,4.9 29.95,4.9 SW1.2 | v35.81,15.54 35.81,20.57 R5.2
  Bottom 0.152: v30.96,4.9 30.96,5.41 30.5,5.87 R2.2 32.51,8.76 32.51,11.3 33.81,12.6 35.81,12.6 v35.81,15.54
N$8  (via drill 0.3)
  Top 0.152: v44.35,26.98 43.28,26.98 D2.A
  Bottom 0.152: v44.35,26.98 43.13,26.98 R7.2
N$9
  Bottom 0.152: C14.1 10.31,28.04 11.58,27.74 R6.1
N$10  (via drill 0.3)
  Top 0.152: v18.03,24.33 18.9,24.23 U$1.1
  Bottom 0.152: D1.3 11.28,24.23 12.19,24.23 13.56,25.6 R6.2 13.72,25.76 15.09,25.76 16,26.67 C15.1 16.15,26.67 17.37,25.45 | v18.03,24.33 17.98,24.84 17.37,25.45 | 17.37,25.45 16.15,24.23 16.15,23.62 JP2.2
N$11  (via drill 0.3)
  Top 0.152: v44.5,22.25 43.28,22.25 D3.A
  Bottom 0.152: v44.5,22.25 43.28,22.25 R8.2
N$13
  Bottom 0.152: JP25.2 46.35,33.91 46.74,34.29 48.9,34.29 49.53,34.92 49.53,39.12 JP24.1
N$15  (via drill 0.3)
  Top 0.152: v44.35,24.69 43.28,24.69 D4.A
  Bottom 0.152: v44.35,24.69 43.13,24.69 R9.2
NRST  (via drill 0.3)
  Top 0.152: U$1.7 21.03,21.95 v19.36,20.27 18.85,19.76 17.27,19.76 11.89,25.15 v7.62,25.15 | S1.P$3 17.61,11.8 v19.05,10.36 20.49,11.8 S1.P$4
  Bottom 0.152: v19.36,20.27 19.36,11.28 19.66,10.97 | 19.66,10.97 20.42,10.21 C11.1 19.66,10.97 | v7.62,25.15 6.25,25.15 R1.2 | 19.66,10.97 v19.05,10.36
PWM1
  Top 0.152: U$1.14 23.62,19.66 24.54,20.57 24.54,31.39 24.99,31.85 24.99,35.51 24.38,36.12 24.38,45.85 JP10.3
PWM2
  Top 0.152: U$1.15 23.77,19.2 23.47,18.9 14.48,18.9 9.75,23.62 3.91,23.62 1.78,21.49 JP12.3
PWM3
  Top 0.152: U$1.16 24.23,18.75 24.23,17.32 26.85,14.45 26.85,2.95 27.89,2.03 JP13.3
PWM4  (via drill 0.3)
  Top 0.152: U$1.17 26.98,18.75 30.48,15.24 31.24,15.24 32,14.48 32,12.57 v33.53,10.79 | v36.96,10.79 41.78,10.79 45.34,14.35 JP14.3
  Bottom 0.152: v33.53,10.79 v36.96,10.79
PWM5  (via drill 0.3)
  Top 0.152: v45.21,28.83 32.26,28.83 31.5,29.59 30.66,29.59 30.18,29.11 30.18,29.04 U$1.39
  Bottom 0.152: v45.21,28.83 45.26,28.78 45.26,26.82 45.39,13.13 JP17.3
PWM6
  Top 0.152: U$1.37 30.48,27.93 30.48,27.3 34.8,22.99 34.8,15.75 35.43,14.99 35.43,10.41 37.85,8.13 JP15.3
PWM7  (via drill 0.3)
  Top 0.152: v29.87,27.74 29.87,28.04 30.33,28.5 U$1.38
  Bottom 0.152: v29.87,27.74 40.23,17.37 40.23,12.88 JP16.3
PWM8
  Top 0.152: U$1.27 30.48,22.25 32,20.73 32,18.19 34.98,14.96 34.98,10.72 32.77,8.38 JP18.3
RX1
  Top 0.152: JP27.2 36.55,38.1 28.8,30.48 U$1.43
RX2  (via drill 0.3)
  Top 0.152: v32,22.4 32,22.86 31.55,23.32 U$1.30
  Bottom 0.152: v32,22.4 32,22.1 24.38,14.48 24.38,12.04 21.34,8.99 9.3,8.99 6.1,12.19 4.12,12.19 3.81,11.89 3.81,8.64 4.19,8.26 6.48,8.26 11.94,2.79 JP26.2
RX3  (via drill 0.3, 0.6)
  Top 0.152: v22.4,28.96 23.62,30.18 23.62,30.48 23.32,30.79 23.32,31.09 U$1.52 | v33.27,36.58 37.59,40.89 40.77,40.89 41.78,41.91 43.18,41.91 46.99,38.1 JP24.2
  Bottom 0.152: v22.4,28.96 22.1,28.96 21.49,28.35 21.49,28.04 24.38,25.15 25.76,25.15 28.96,28.35 32.66,28.35 33.27,28.96 v33.27,36.58
SCL1  (via drill 0.3)
  Top 0.152: v22.1,28.19 21.95,28.19 21.18,28.96 U$1.58 | v25.45,21.34 25.45,28.35 25.91,28.8 25.91,34.44 28.04,36.58 JP9.4
  Bottom 0.152: JP22.2 1.52,16.61 5.03,16.61 R13.1 5.18,16.76 10.82,16.76 15.09,21.03 24.84,21.03 25.15,21.34 v25.45,21.34 | v22.1,28.19 25.91,28.19 26.98,27.13 30.02,30.18 30.02,34.75 28.19,36.58 JP9.4
SCL2  (via drill 0.3)
  Top 0.152: v30.63,30.94 29.41,29.72 U$1.41 | JP21.2 30.18,47.83 30.18,45.64 JP20.2 30.1,40.89 R14.1
  Bottom 0.152: v30.63,30.94 30.63,45.03 30.3,45.36 JP20.2
SDA1  (via drill 0.3)
  Top 0.152: v19.81,31.75 19.81,29.41 20.57,28.65 U$1.59 | JP22.1 1.78,14.78 5.03,18.29 v5.03,23.01
  Bottom 0.152: R12.1 5.03,13.87 2.29,13.87 JP22.1 | JP9.3 25.6,36.73 24.08,38.25 20.42,38.25 19.36,37.19 19.36,36.12 19.81,35.66 v19.81,31.75 17.68,31.75 10.82,25.15 10.36,25.15 9.14,26.36 5.18,26.36 5.03,26.21 v5.03,23.01
SDA2
  Top 0.152: U$1.40 29.72,29.26 29.41,28.96 27.89,28.96 26.21,30.63 26.21,32.92 32.61,39.32 32.61,44.98 JP20.1 32.77,46.02 | 32.77,46.02 35.51,46.02 R15.1 | 32.77,46.02 32.77,47.83 JP21.1
TX1
  Top 0.152: U$1.42 29.11,30.18 34.47,35.53 35.89,35.53 JP27.3
TX2  (via drill 0.3)
  Top 0.152: v26.98,20.27 30.18,23.47 30.79,23.47 31.09,23.16 U$1.29 | v23.01,15.54 17.83,15.54 10.97,8.69 10.97,5.64 JP26.3
  Bottom 0.152: v26.98,20.27 26.98,19.51 v23.01,15.54
TX3  (via drill 0.3)
  Top 0.152: v21.79,33.22 23.47,31.55 U$1.51 | v29.41,34.59 32.46,34.59 37.34,39.34 43.59,39.34 43.94,38.99 43.94,36.07 44.6,35.53 48.06,35.53 JP24.3
  Bottom 0.152: v21.79,33.22 21.79,37.03 22.71,37.95 23.47,37.95 24.38,37.03 24.38,36.12 25.91,34.59 v29.41,34.59
US_ECHO
  Top 0.152: U$1.36 31.24,28.04 31.7,28.5 44.65,28.5 46.1,27.05 46.1,23.88 47.62,22.35 JP11.3
US_TRIGGER
  Top 0.152: U$1.35 31.55,27.58 32.16,28.19 44.32,28.19 45.59,26.92 45.59,22.1 47.88,19.81 JP11.4
VCCIO
  Top 0.813: JP18.2 JP16.2 JP15.2 JP17.2 40.89,4.7 43.69,7.49 JP5.2
VDD  (via drill 0.3)
  Top 0.305: v39.62,42.04 43.69,42.04 44.07,41.66 46.99,41.66 47.24,41.91 48.64,41.91 49.53,41.02 49.53,34.54 JP24.4
  Top 0.406: JP19.1 38.1,45.6 C8.1 38.73,43.06 v39.62,42.04
  Bottom 0.152: 37.03,43.28 JP23.1 | 34.59,39.93 IC1.3 34.52,39.85 34.67,40.01
  Bottom 0.254: 49.53,31.75 49.4,18.8
  Bottom 0.305: JP24.4 48.39,33.02 49.53,31.75 | 49.4,18.8 JP11.5
  Bottom 0.406: v39.62,42.04 38.67,43.43 JP23.1 | 34.67,40.01 34.54,39.88 | JP24.4 45.41,33.02 JP25.1 | 37.03,43.28 35.53,43.28 34.42,42.16 34.42,39.93 IC1.3
  pour Top (isolate 0.203): 37.72,50.42 37.47,49.28 37.59,41.78 44.07,41.78 44.58,-0.25 50.04,-0.64 49.91,50.29

### Text on the board
tNames: ~ | - | 3V | - | 5V | PWM1 | JTAG 2 | SCL | SDA | DTR | I²C2 | RX | RX | IMU | JTAG 1 | TX | Telemetry | TX | GPS | 3V | 5V | JTAG 0 | - | - | PWR | - | - | TG | LED2 | LED1 | EC | PWM2 | ~ | 5V | SRF-04 | SDA | I²C1 | ~ | SCL | B0 | B1 | 3V | PWM4 | 5V | PWM8 | PWM7 | PWM6 | PWM5 | - | ~ | Debug | PWM3 | CD | RX | TX | 3V | - | - | ~ | + | -
bNames: GND | 5V